# Altium schematic sheet CurrentMeasure_FileInfo.SchDoc
size A; SheetNumber: 2; SheetTotal: 3
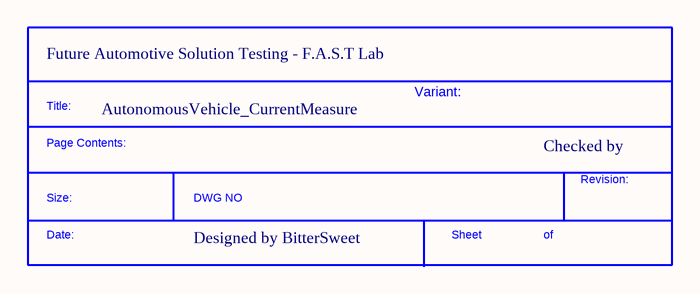
[diagram p0: CurrentMeasure_FileInfo.SchDoc]

## Parts
*?  SDTitleBlock  (value not drawn)  (graphical)

## Notes on the sheet
- (near *?) Future Automotive Solution Testing - F.A.S.T Lab
- AutonomousVehicle_CurrentMeasure
- Variant:
- Checked by
- Designed by BitterSweet
- (in symbol SDTitleBlock) Title:; Page Contents:; Revision:; Size:; DWG NO; Date:; Sheet; of